# EAGLE design ESP32FishLightBoard (EAGLE 9.6.2)
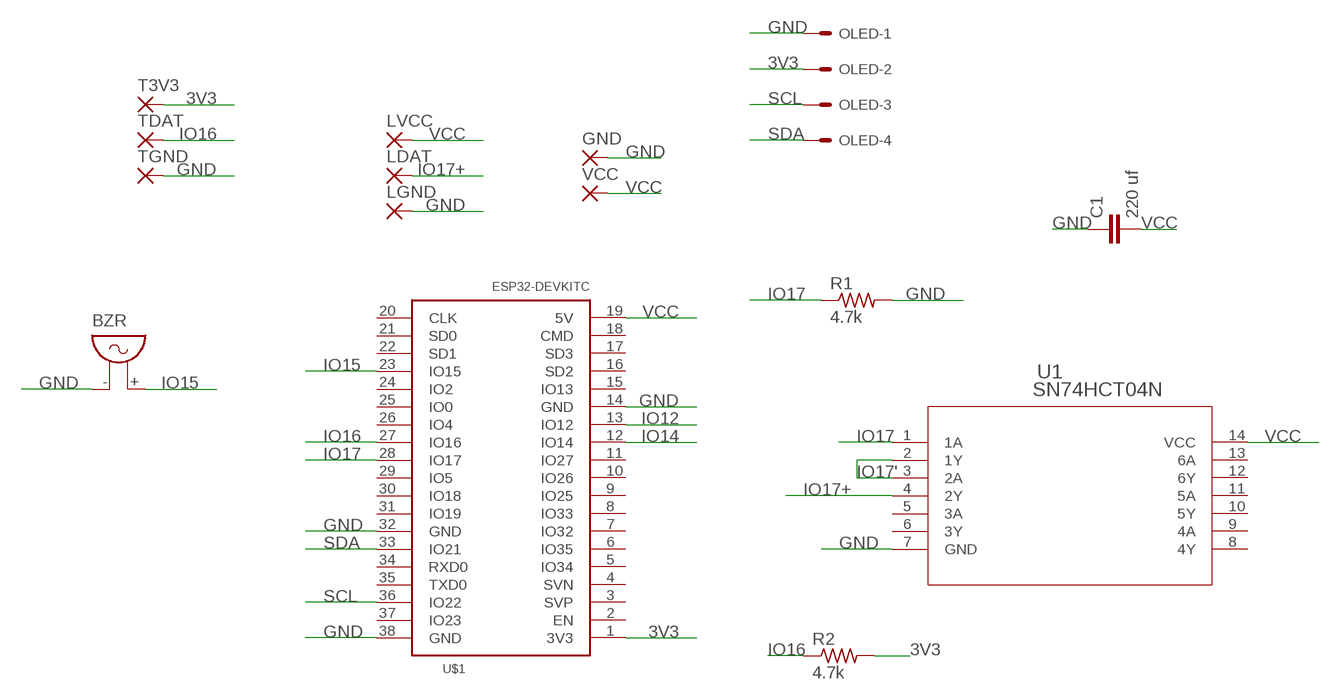
[diagram p0: schematic, sheet 1]

## Parts
BZR  F/QMX  [F/QMX]
C1  220 uf  C2,5-3  [C2.5-3]
GND  WIREPAD2,54/1,0  [2,54/1,0]
LDAT  WIREPAD2,54/1,0  [2,54/1,0]
LGND  WIREPAD2,54/1,0  [2,54/1,0]
LVCC  WIREPAD2,54/1,0  [2,54/1,0]
OLED  22-27-2041-04  [6410-04]
R1  4.7k  FLIPFLOP-RES  [0805-THM]
R2  4.7k  FLIPFLOP-RES  [0805-THM]
T3V3  WIREPAD2,54/1,0  [2,54/1,0]
TDAT  WIREPAD2,54/1,0  [2,54/1,0]
TGND  WIREPAD2,54/1,0  [2,54/1,0]
U1  SN74HCT04N  [N14]
U$1  ESP32DEVKITC-LIGHT  [ESP32-DEVKITC-LIGHT]
VCC  WIREPAD2,54/1,0  [2,54/1,0]

## Nets
3V3: OLED.2 R2.2 T3V3.1(P) U$1.1(3V3)
GND [led_vcc]: BZR.- C1.1 GND.1(P) LGND.1(P) OLED.1 R1.2 TGND.1(P) U1.7(GND) U$1.14(GND) U$1.32(GND) U$1.38(GND)
IO12: U$1.13(IO12)
IO14: U$1.12(IO14)
IO15: BZR.+ U$1.23(IO15)
IO16: R2.1 TDAT.1(P) U$1.27(IO16)
IO17 [data]: R1.1 U1.1(1A) U$1.28(IO17)
IO17' [data]: U1.2(1Y) U1.3(2A)
IO17+ [data]: LDAT.1(P) U1.4(2Y)
SCL: OLED.3 U$1.36(IO22)
SDA: OLED.4 U$1.33(IO21)
VCC [led_vcc]: C1.2 LVCC.1(P) U1.14(VCC) U$1.19(5V) VCC.1(P)
Unconnected: U1.5(3A) U1.6(3Y) U1.8(4Y) U1.9(4A) U1.10(5Y) U1.11(5A) U1.12(6Y) U1.13(6A) U$1.2(EN) U$1.3(SVP) U$1.4(SVN) U$1.5(IO34) U$1.6(IO35) U$1.7(IO32) U$1.8(IO33) U$1.9(IO25) U$1.10(IO26) U$1.11(IO27) U$1.15(IO13) U$1.16(SD2) U$1.17(SD3) U$1.18(CMD) U$1.20(CLK) U$1.21(SD0) U$1.22(SD1) U$1.24(IO2) U$1.25(IO0) U$1.26(IO4) U$1.29(IO5) U$1.30(IO18) U$1.31(IO19) U$1.34(RXD0) U$1.35(TXD0) U$1.37(IO23)

## Library data of the parts
BZR = buzzer:F/QMX: BUZZER Source: Buerklin; OC_FARNELL: unknown; OC_NEWARK: unknown
C1 = capacitor-wima:C: CAPACITOR naming: grid - package width
GND LDAT LGND LVCC T3V3 TDAT TGND VCC = wirepad:WIREPAD: Wire PAD connect wire on PCB
OLED = con-molex:22-?-04: CONNECTOR wire to board 2.54 mm (.1 inch) pitch header; MF: MOLEX; OC_FARNELL: unknown; OC_NEWARK: unknown
R1 R2 = adafruit:FLIPFLOP-RES: Flip Flop resistor An 0805 resistor inside a standard 1/4W 5% resistor. Makes for easy mods
U1 = UltralibrarianImported:SN74HCT04N; DATASHEET_URL: http://www.ti.com/lit/gpn/SN74HCT04; DESCRIPTION: Hex Inverters; FAMILY_NAME: INVERTING BUFFER/DRIVER; GENERIC_PART_NUMBER: SN74HCT04; INDUSTRY_STD_PKG_TYPE: PDIP; MANUFACTURER: Texas Instruments; PACKAGE_DESIGNATOR: N; PIN_COUNT: 14
U$1 = ESP32-DEVKITC_ataboo:ESP32DEVKITC-LIGHT

## Net classes
1 data: width 0.203 mm, clearance 0.203 mm
2 led_vcc: width 0.508 mm, clearance 0.508 mm

## Board
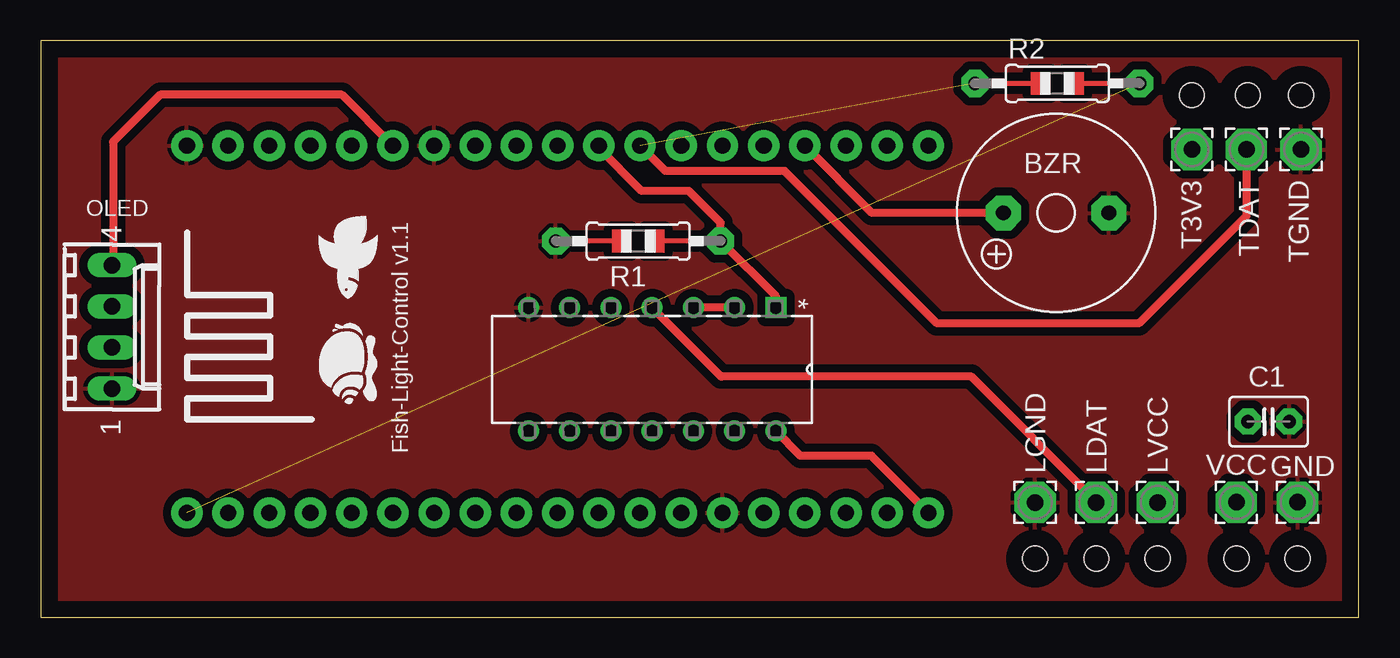
[diagram p1: board, top side]
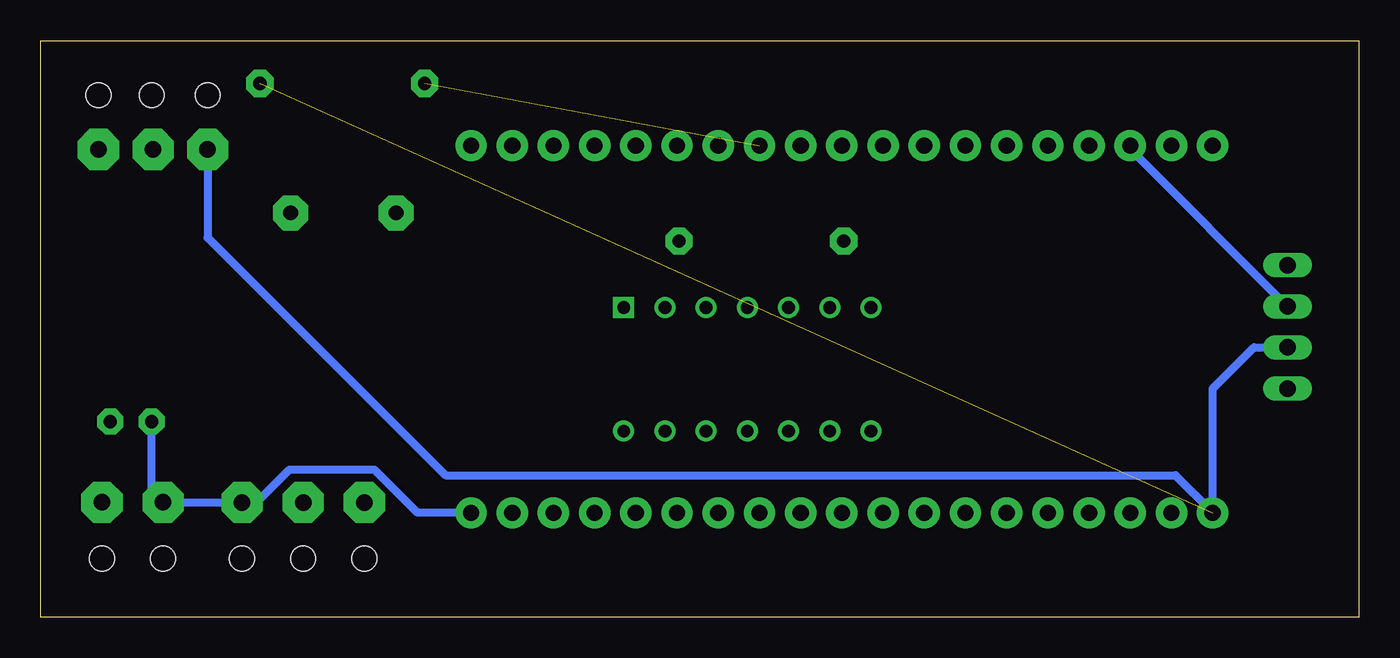
[diagram p2: board, bottom side, seen from below]

Size 81.28 x 35.56 mm. Coordinates in mm from the lower left corner, seen from the top.
Outline: 0,0 81.28,0 81.28,35.56 0,35.56 0,0
Copper layers (1*16): Top 0.035mm / dielectric 1.5mm / Bottom 0.035mm
Design rules "default": minimum track width 6mil, minimum drill 0.35mm, track to track 6mil, track to pad 6mil, pad to pad 6mil, via to via 6mil, smd to smd 6mil, copper to edge 40mil, drill to drill 6mil, minimum pad ring 10mil, minimum via ring 8mil, stop-mask expansion 4mil, vias tented up to drill 0mil, thermal gap 10mil
Holes 1.52 mm at 65.09,3.61 68.86,3.61 61.32,3.61 77.5,3.62 73.73,3.62 77.7,32.19 74.42,32.19 70.98,32.19

### Footprints (pad centres in the part's own frame; a part is rotated, then mirrored left to right if it is on the bottom)
F/QMX = drill 0.914 pad 2.159 octagon: + 3.251,0; - -3.251,0
C2.5-3 = drill 0.813 pad 1.6 octagon: 1 -1.27,0; 2 1.27,0
2,54/1,0 = drill 1.016 pad 2.54 octagon: 1 0,0
6410-04 = drill 1.016 long: 1 3.81,0; 2 1.27,0; 3 -1.27,0; 4 -3.81,0
0805-THM = drill 0.813 pad 1.676 octagon: 1 -5.08,0; 2 5.08,0
N14 = drill 0.787 pad 1.295 square: 1 -7.62,15.24 | drill 0.787 pad 1.295: 2 -7.62,12.7; 3 -7.62,10.16; 4 -7.62,7.62; 5 -7.62,5.08; 6 -7.62,2.54; 7 -7.62,0; 8 0,0; 9 0,2.54; 10 0,5.08; 11 0,7.62; 12 0,10.16; 13 0,12.7; 14 0,15.24
ESP32-DEVKITC-LIGHT = drill 1 pad 1.93: 1 -22.87,-11.42; 2 -20.33,-11.42; 3 -17.79,-11.42; 4 -15.25,-11.42; 5 -12.71,-11.42; 6 -10.17,-11.42; 7 -7.63,-11.42; 8 -5.09,-11.42; 9 -2.55,-11.42; 10 -0.01,-11.42; 11 2.53,-11.42; 12 5.07,-11.42; 13 7.61,-11.42; 14 10.15,-11.42; 15 12.69,-11.42; 16 15.23,-11.42; 17 17.77,-11.42; 18 20.31,-11.42; 19 22.85,-11.42; 20 22.85,11.23; 21 20.31,11.23; 22 17.77,11.23; 23 15.23,11.23; 24 12.69,11.23; 25 10.15,11.23; 26 7.61,11.23; 27 5.07,11.23; 28 2.53,11.23; 29 -0.01,11.23; 30 -2.55,11.23; 31 -5.09,11.23; 32 -7.63,11.23; 33 -10.17,11.23; 34 -12.71,11.23; 35 -15.25,11.23; 36 -17.79,11.23; 37 -20.33,11.23; 38 -22.87,11.23

### Placement (x,y rotation side)
BZR  62.61,24.93 180 top
C1  75.71,12.06 180 top
GND  77.5,7.08 270 top
LDAT  65.09,7.08 270 top
LGND  61.32,7.08 270 top
LVCC  68.86,7.08 270 top
OLED  4.4,17.9 270 top
R1  36.84,23.2 180 top
R2  62.68,32.92 0 top
T3V3  70.98,28.84 90 top
TDAT  74.34,28.84 90 top
TGND  77.71,28.84 90 top
U1  30.09,11.47 270 top
U$1  31.89,17.85 0 top
VCC  73.73,7.08 270 top

### Tracks (layer width: path | path; a pad name or v marks a point on that pad's centre or on a via)
3V3  (1 unrouted)
  Bottom 0.508: T3V3.1 70.98,23.41 56.32,8.75 11.31,8.75 9.02,6.46 U$1.1 9.02,14.09 6.48,16.63 OLED.2
GND
  pour Top: 1.02,34.54 1.02,1.02 80.27,1.02 80.27,34.54
IO15
  Top 0.508: BZR.+ 51.27,24.93 U$1.23
IO16  (1 unrouted)
  Top 0.508: TDAT.1 74.34,24.75 67.71,18.11 55.28,18.11 45.87,27.52 38.53,27.52 U$1.27
IO17
  Top 0.508: U1.1 45.33,19.79 R1.1 41.92,24.33 39.97,26.29 37.06,26.29 34.42,28.92 U$1.28
IO17'
  Top 0.508: U1.2 U1.3
IO17+
  Top 0.508: U1.4 41.96,14.83 57.38,14.83 65.09,7.12 LDAT.1
SCL
  Bottom 0.508: U$1.36 14.1,28.87 OLED.3
SDA
  Top 0.508: U$1.33 18.58,32.22 7.37,32.22 4.47,29.32 4.47,21.78 OLED.4
VCC
  Top 0.508: U1.14 46.84,9.96 51.23,9.96 54.74,6.45 U$1.19
  Bottom 0.508: U$1.19 58.03,6.43 60.7,9.11 65.93,9.11 67.96,7.08 LVCC.1 68.28,7.08 VCC.1 74.44,7.79 C1.2

### Text on the board
tNames: Fish-Light-Control v1.1